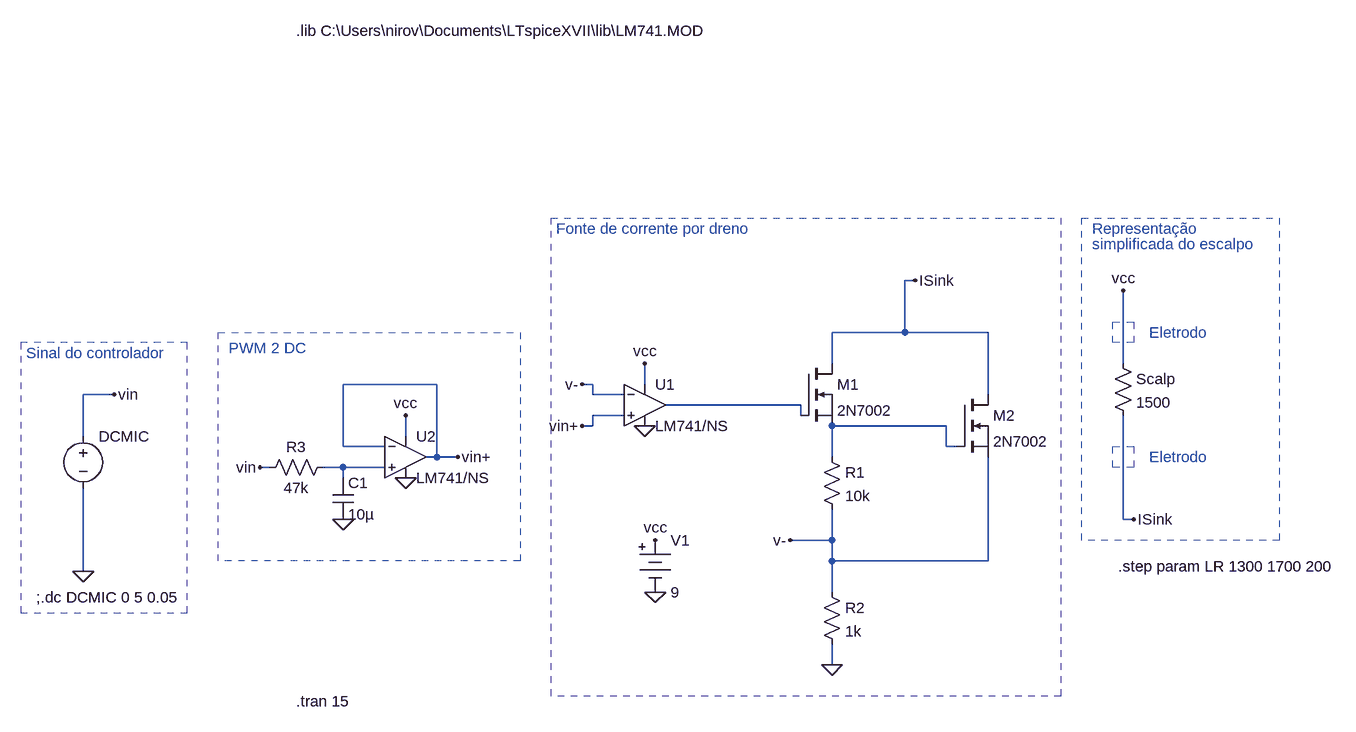
[diagram p0: schematic tDCS_schematics.asc]
tDCS_schematics.asc, the LTspice schematic file:
Version 4
SHEET 1 1512 680
WIRE 832 -304 816 -304
WIRE 816 -224 816 -304
WIRE 816 -224 704 -224
WIRE 944 -224 816 -224
WIRE 704 -176 704 -224
WIRE 1152 -176 1152 -288
WIRE 96 -144 -48 -144
WIRE 336 -144 320 -144
WIRE 416 -144 416 -176
WIRE -400 -128 -448 -128
WIRE 336 -128 336 -144
WIRE 384 -128 336 -128
WIRE 944 -128 944 -224
WIRE 656 -112 448 -112
WIRE 384 -96 336 -96
WIRE 656 -96 656 -112
WIRE 336 -80 336 -96
WIRE 336 -80 320 -80
WIRE 880 -80 704 -80
WIRE -448 -64 -448 -128
WIRE 48 -64 48 -96
WIRE -48 -48 -48 -144
WIRE 16 -48 -48 -48
WIRE 880 -48 880 -80
WIRE 896 -48 880 -48
WIRE 96 -32 96 -144
WIRE 96 -32 80 -32
WIRE 128 -32 96 -32
WIRE 704 -32 704 -80
WIRE -160 -16 -176 -16
WIRE -48 -16 -80 -16
WIRE 16 -16 -48 -16
WIRE -48 0 -48 -16
WIRE 1152 64 1152 -96
WIRE 1168 64 1152 64
WIRE 704 96 704 48
WIRE 704 96 640 96
WIRE 704 128 704 96
WIRE 944 128 944 -32
WIRE 944 128 704 128
WIRE -448 144 -448 16
WIRE 704 176 704 128
WIRE 704 288 704 256
FLAG 432 96 vcc
FLAG 432 176 0
FLAG -448 144 0
FLAG -400 -128 vin
FLAG 416 -176 vcc
FLAG 320 -144 v-
FLAG 640 96 v-
FLAG 1152 -288 vcc
FLAG 704 288 0
FLAG 416 -80 0
FLAG 320 -80 vin+
FLAG 832 -304 ISink
FLAG 1168 64 ISink
FLAG 48 -96 vcc
FLAG 48 0 0
FLAG 128 -32 vin+
FLAG -48 64 0
FLAG -176 -16 vin
SYMBOL Misc\\battery 432 80 R0
WINDOW 123 0 0 Left 0
WINDOW 39 0 0 Left 0
SYMATTR InstName V1
SYMATTR Value 9
SYMBOL voltage -448 -80 R0
WINDOW 123 0 0 Left 0
WINDOW 39 0 0 Left 0
WINDOW 3 24 44 Invisible 2
SYMATTR Value PULSE(0 5 0 1n 1n 0.8m 2m)
SYMATTR InstName DCMIC
SYMBOL OpAmps\\opamp2 416 -176 R0
SYMATTR InstName U1
SYMATTR Value LM741/NS
SYMATTR SpiceModel LM741/NS
SYMBOL res 688 -48 R0
SYMATTR InstName R1
SYMATTR Value 10k
SYMBOL res 688 160 R0
SYMATTR InstName R2
SYMATTR Value 1k
SYMBOL res 1136 -192 R0
SYMATTR InstName Scalp
SYMATTR Value 1500
SYMBOL nmos 656 -176 R0
SYMATTR InstName M1
SYMATTR Value 2N7002
SYMBOL nmos 896 -128 R0
SYMATTR InstName M2
SYMATTR Value 2N7002
SYMBOL OpAmps\\opamp2 48 -96 R0
SYMATTR InstName U2
SYMATTR Value LM741/NS
SYMATTR SpiceModel LM741/NS
SYMBOL cap -64 0 R0
SYMATTR InstName C1
SYMATTR Value 10µ
SYMBOL res -64 -32 R90
WINDOW 0 0 56 VBottom 2
WINDOW 3 32 56 VTop 2
SYMATTR InstName R3
SYMATTR Value 47k
TEXT -520 184 Left 2 !;.dc DCMIC 0 5 0.05
TEXT -120 -688 Left 2 !.lib C:\\Users\\nirov\\Documents\\LTspiceXVII\\lib\\LM741.MOD
TEXT 1144 136 Left 2 !.step param LR 1300 1700 200
TEXT 1192 -224 Left 2 ;Eletrodo
TEXT 1192 -32 Left 2 ;Eletrodo
TEXT -536 -192 Left 2 ;Sinal do controlador
TEXT 280 -384 Left 2 ;Fonte de corrente por dreno
TEXT 1104 -384 Left 2 ;Representação
TEXT 1104 -360 Left 2 ;simplificada do escalpo
TEXT -120 344 Left 2 !.tran 15
TEXT -224 -200 Left 2 ;PWM 2 DC
RECTANGLE Normal 1168 -16 1136 -48 2
RECTANGLE Normal 1168 -208 1136 -240 2
RECTANGLE Normal -544 208 -288 -208 2
RECTANGLE Normal 1056 336 272 -400 2
RECTANGLE Normal 1392 96 1088 -400 2
RECTANGLE Normal -240 -224 224 128 2

The netlist it stands for:
* tDCS_schematics.asc
V1 vcc 0 9
V§DCMIC vin 0 PULSE(0 5 0 1n 1n 0.8m 2m)
XU1 vin+ v- vcc 0 N001 LM741/NS LM741/NS  ; pins In+ In- V+ V- OUT
R1 N002 v- 10k
R2 v- 0 1k
R§Scalp vcc ISink 1500
M1 ISink N001 N002 N002 2N7002
M2 ISink N002 v- v- 2N7002
XU2 N003 vin+ vcc 0 vin+ LM741/NS LM741/NS  ; pins In+ In- V+ V- OUT
C1 N003 0 10µ
R3 N003 vin 47k
.model NMOS NMOS
.model PMOS PMOS
.lib standard.mos
;.dc DCMIC 0 5 0.05
.lib C:\Users\nirov\Documents\LTspiceXVII\lib\LM741.MOD
.step param LR 1300 1700 200
* Eletrodo
* Eletrodo
* Sinal do controlador
* Fonte de corrente por dreno
* Representação
* simplificada do escalpo
.tran 15
* PWM 2 DC
.backanno
.end